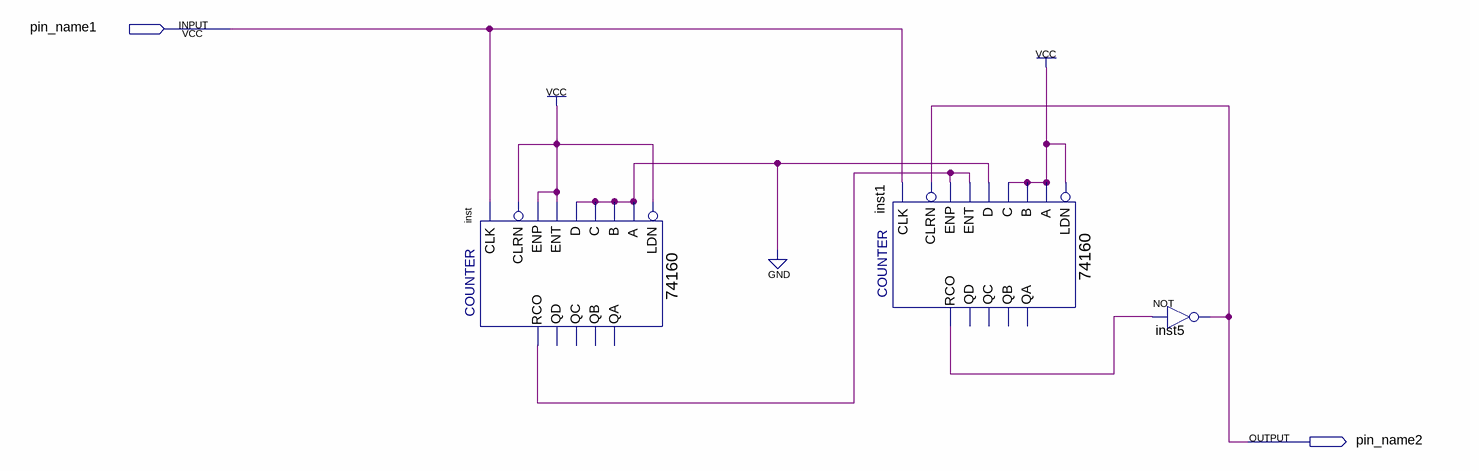
[diagram p0: schematic sheet]
// Quartus schematic Block1.bdf as structural Verilog: 3 symbols, 2 pins
module Block1 (
  input  pin_name1,
  output pin_name2
);

  wire inst1_rco, inst_rco;

  \74160  inst (
    .CLK(pin_name1), .ENT(1'b1), .A(1'b0), .B(1'b0), .C(1'b0), .D(1'b0), .LDN(1'b1), .ENP(1'b1), .CLRN(1'b1),
    .RCO(inst_rco));  // open: QD, QA, QB, QC
  \74160  inst1 (
    .CLK(pin_name1), .ENT(inst_rco), .A(1'b1), .B(1'b1), .C(1'b1), .D(1'b0), .LDN(1'b1), .ENP(inst_rco),
    .CLRN(pin_name2), .RCO(inst1_rco));  // open: QD, QA, QB, QC
  not inst5 (pin_name2, inst1_rco);
endmodule
